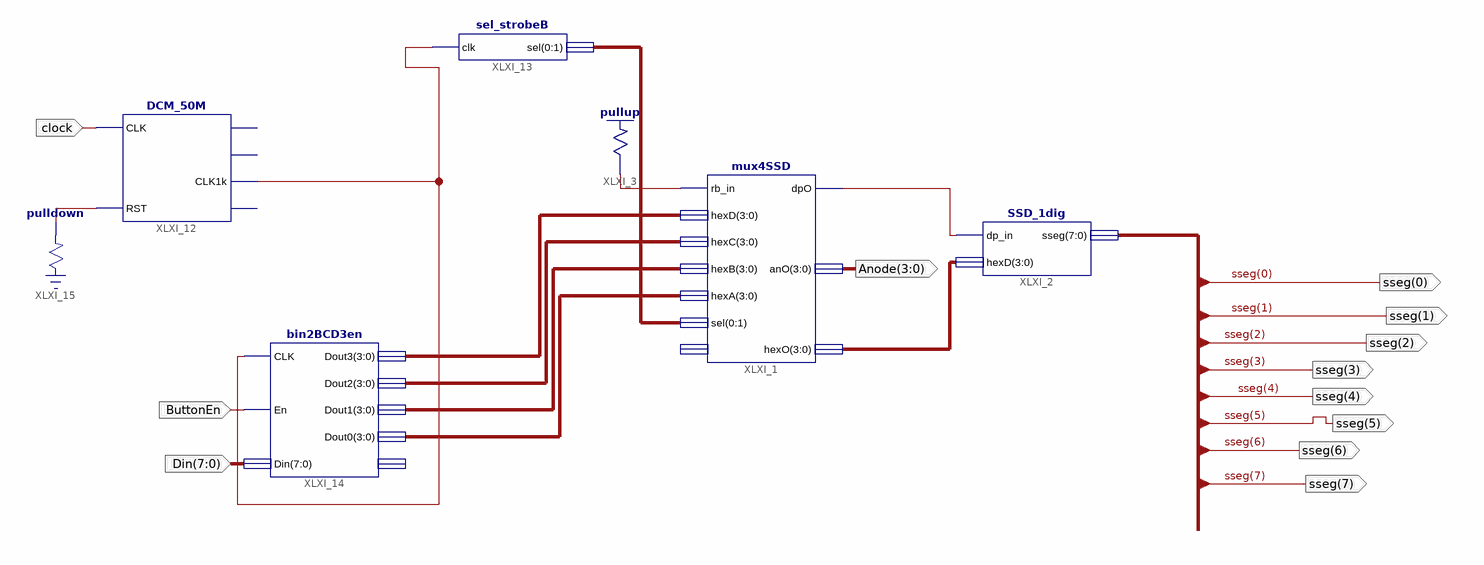
[diagram p0: schematic sheet 1]
// Xilinx ISE schematic SSD_Driver.sch (spartan3e) as structural Verilog: 7 symbols, 12 ports
module SSD_Driver (
  input  ButtonEn,
  input  [7:0] Din,
  input  clock,
  output [7:0] sseg,
  output [3:0] Anode
);

  wire XLXN_5, XLXN_8, XLXN_33, XLXN_36;
  wire [1:0] XLXN_41;
  wire [3:0] XLXN_7, XLXN_37, XLXN_38, XLXN_39, XLXN_40;

  SSD_1dig XLXI_2 (.dp_in(XLXN_8), .hexD(XLXN_7), .sseg(sseg));
  \pullup  XLXI_3 (.O(XLXN_5));
  mux4SSD XLXI_1 (
    .rb_in(XLXN_5), .hexD(XLXN_37), .hexC(XLXN_38), .hexB(XLXN_39), .hexA(XLXN_40),
    .sel({XLXN_41[0], XLXN_41[1]}), .dpO(XLXN_8), .anO(Anode), .hexO(XLXN_7));  // open: dp_in
  DCM_50M XLXI_12 (.CLK(clock), .RST(XLXN_33), .CLK1k(XLXN_36));  // open: CLK1M, CLK10k, CLK1
  sel_strobeB XLXI_13 (.clk(XLXN_36), .sel({XLXN_41[0], XLXN_41[1]}));
  bin2BCD3en XLXI_14 (
    .CLK(XLXN_36), .En(ButtonEn), .Din(Din), .Dout3(XLXN_37), .Dout2(XLXN_38), .Dout1(XLXN_39),
    .Dout0(XLXN_40));  // open: RBout
  \pulldown  XLXI_15 (.O(XLXN_33));
endmodule
